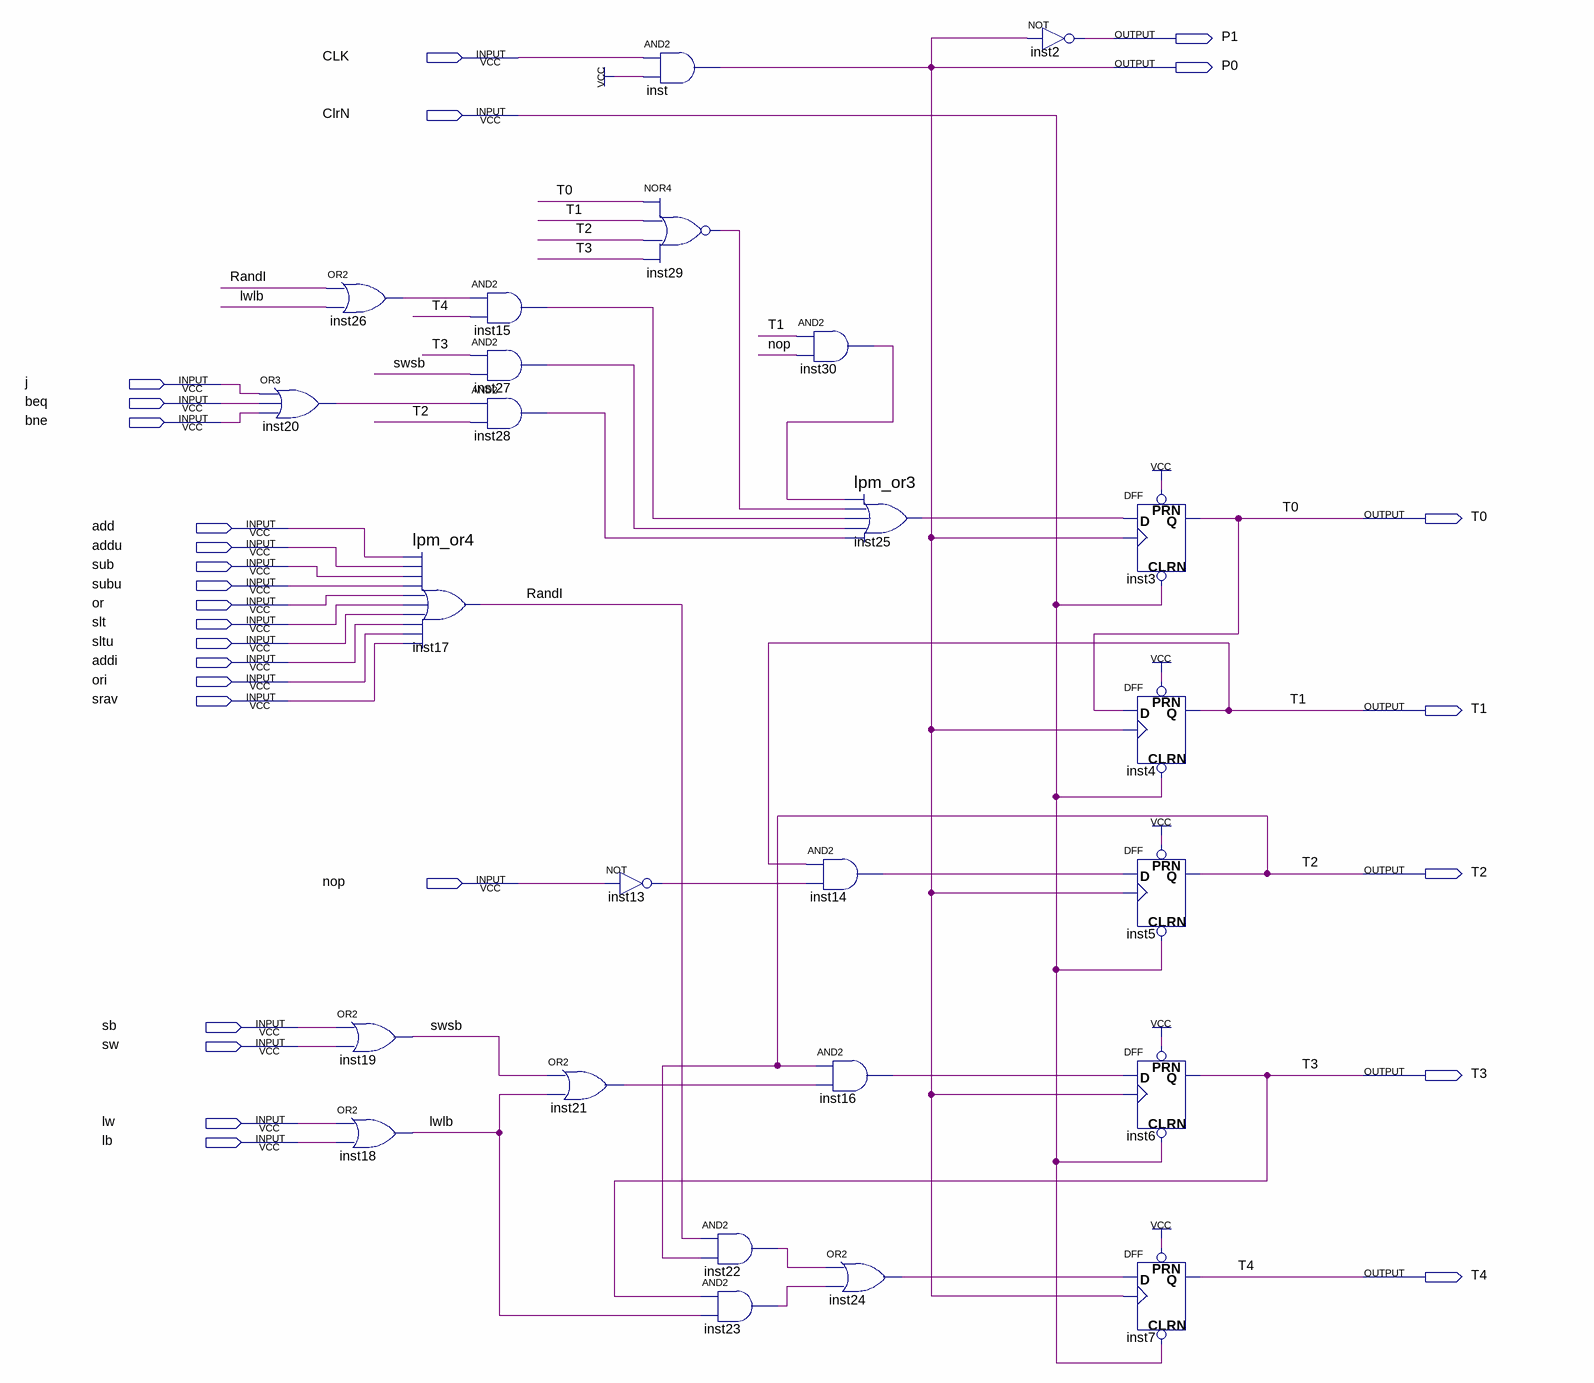
[diagram p0: schematic sheet]
// Quartus schematic TSG.bdf as structural Verilog: 25 symbols, 27 pins
module TSG (
  input  CLK,
  input  ClrN,
  input  j,
  input  beq,
  input  bne,
  input  add,
  input  addu,
  input  sub,
  input  subu,
  input  \or ,
  input  slt,
  input  sltu,
  input  addi,
  input  ori,
  input  srav,
  input  nop,
  input  sb,
  input  sw,
  input  lw,
  input  lb,
  output P1,
  output P0,
  output T0,
  output T1,
  output T2,
  output T3,
  output T4
);

  wire inst13_out, inst14_out, inst15_out, inst16_out, inst20_out, inst21_out, inst22_out, inst23_out,
       inst24_out, inst25_result, inst26_out, inst27_out, inst28_out, inst29_out, inst30_out, lwlb, RandI,
       swsb;

  or inst20 (inst20_out, j, beq, bne);
  or inst26 (inst26_out, RandI, lwlb);
  or inst19 (swsb, sb, sw);
  or inst18 (lwlb, lw, lb);
  lpm_or4 inst17 (
    .data0(add), .data1(addu), .data2(sub), .data3(subu), .data4(\or ), .data5(slt), .data6(sltu),
    .data7(addi), .data8(ori), .data9(srav), .result(RandI));
  and inst15 (inst15_out, inst26_out, T4);
  and inst27 (inst27_out, T3, swsb);
  and inst28 (inst28_out, inst20_out, T2);
  or inst21 (inst21_out, swsb, lwlb);
  and inst (P0, CLK, 1'b1);
  nor inst29 (inst29_out, T0, T1, T2, T3);
  not inst13 (inst13_out, nop);
  and inst22 (inst22_out, RandI, T2);
  and inst23 (inst23_out, T3, lwlb);
  and inst30 (inst30_out, T1, nop);
  and inst14 (inst14_out, T1, inst13_out);
  and inst16 (inst16_out, T2, inst21_out);
  or inst24 (inst24_out, inst22_out, inst23_out);
  lpm_or3 inst25 (
    .data0(inst30_out), .data1(inst29_out), .data2(inst15_out), .data3(inst27_out), .data4(inst28_out),
    .result(inst25_result));
  not inst2 (P1, P0);
  DFF inst3 (.CLRN(ClrN), .CLK(P0), .D(inst25_result), .PRN(1'b1), .Q(T0));
  DFF inst4 (.CLRN(ClrN), .CLK(P0), .D(T0), .PRN(1'b1), .Q(T1));
  DFF inst5 (.CLRN(ClrN), .CLK(P0), .D(inst14_out), .PRN(1'b1), .Q(T2));
  DFF inst6 (.CLRN(ClrN), .CLK(P0), .D(inst16_out), .PRN(1'b1), .Q(T3));
  DFF inst7 (.CLRN(ClrN), .CLK(P0), .D(inst24_out), .PRN(1'b1), .Q(T4));
endmodule
